# EAGLE schematic Electronic DC Load_v2 (EAGLE 8.2.2)
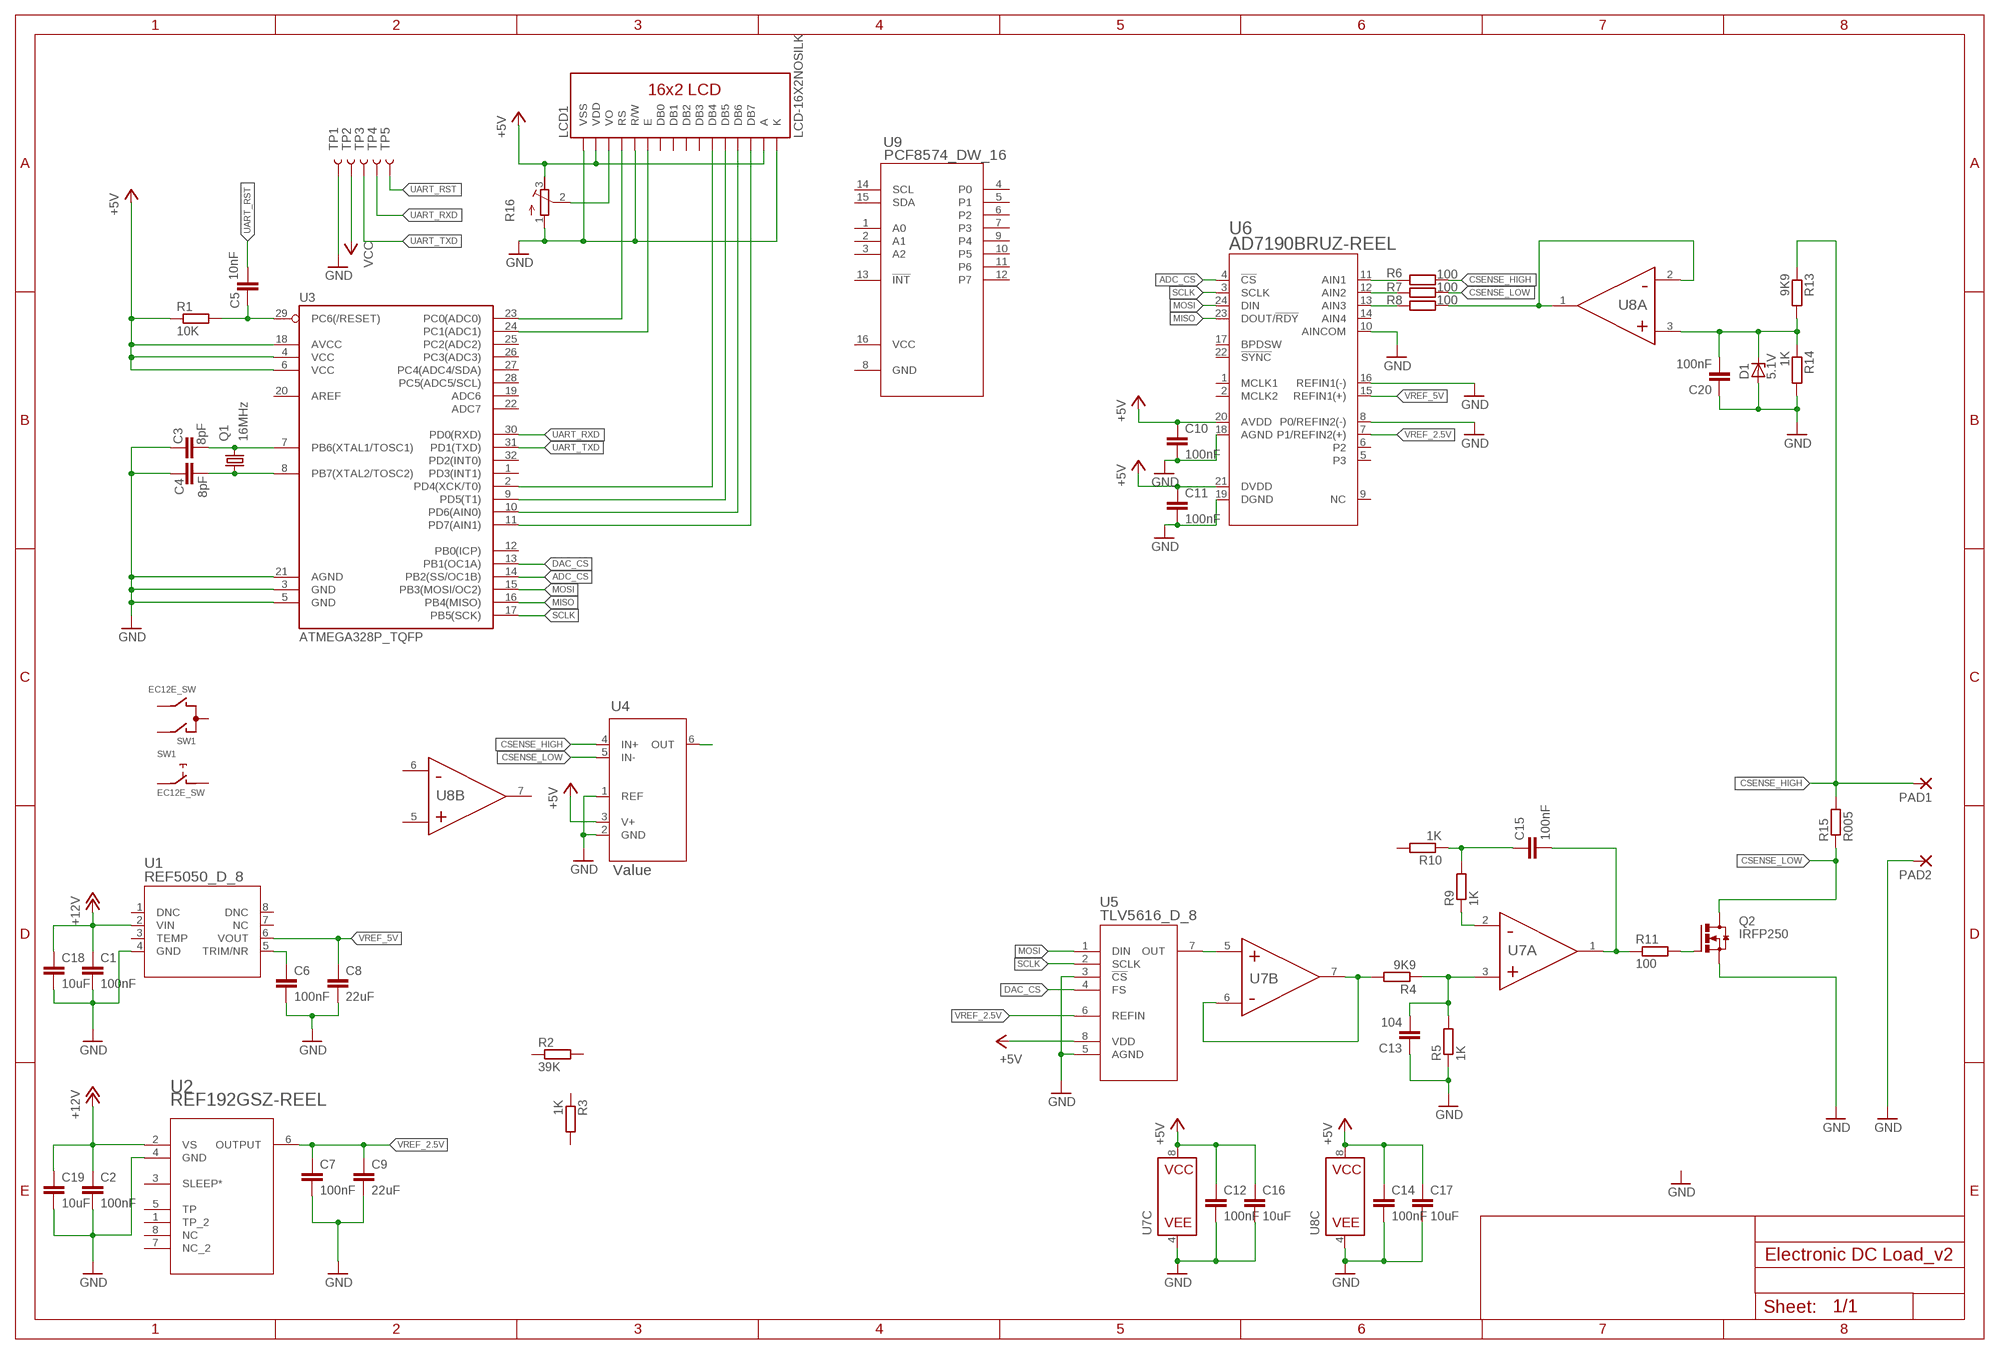
[diagram p0: schematic, sheet 1]

## Parts
C1  100nF  C-EUC1206  [C1206]
C2  100nF  C-EUC1206  [C1206]
C3  8pF  C-EUC0603  [C0603]
C4  8pF  C-EUC0603  [C0603]
C5  10nF  C-EUC0603  [C0603]
C6  100nF  C-EUC1206  [C1206]
C7  100nF  C-EUC1206  [C1206]
C8  22uF  C-EUC1206  [C1206]
C9  22uF  C-EUC1206  [C1206]
C10  100nF  C-EUC0603  [C0603]
C11  100nF  C-EUC0603  [C0603]
C12  100nF  C-EUC1206  [C1206]
C13  104  C-EUC0603  [C0603]
C14  100nF  C-EUC1206  [C1206]
C15  100nF  C-EUC0603  [C0603]
C16  10uF  C-EUC1206  [C1206]
C17  10uF  C-EUC1206  [C1206]
C18  10uF  C-EUC1206  [C1206]
C19  10uF  C-EUC1206  [C1206]
C20  100nF  C-EUC0603  [C0603]
D1  5.1V  ZENER-DIODESOD80C  [SOD80C]
LCD1  LCD-16X2NOSILK  [LCD-16X2_NOSILK]
PAD1  SMD5  [SMD2,54-5,08]
PAD2  SMD5  [SMD2,54-5,08]
Q1  16MHz  KX-7  [3.2X2.5_KX-7]
Q2  IRFP250  [TO-247AD-V]
R1  10K  R-EU_R0603  [R0603]
R2  39K  R-EU_M0805  [M0805]
R3  1K  R-EU_R0805  [R0805]
R4  9K9  R-EU_R0603  [R0603]
R5  1K  R-EU_R0603  [R0603]
R6  100  R-EU_R0805  [R0805]
R7  100  R-EU_R0805  [R0805]
R8  100  R-EU_R0805  [R0805]
R9  1K  R-EU_R0603  [R0603]
R10  1K  R-EU_R0603  [R0603]
R11  100  R-EU_R0603  [R0603]
R13  9K9  R-EU_R0805  [R0805]
R14  1K  R-EU_R0805  [R0805]
R15  R005  MRE_R005_4W_2728  [2728]
R16  R-TRIMM3296X  [RTRIM3296X]
SW1  EC12E_SW  [ALPS_EC12E_SW]
TP1  TEST-POINT2  [PAD.02X.02]
TP2  TEST-POINT3  [PAD.03X.03]
TP3  TEST-POINT3  [PAD.03X.03]
TP4  TEST-POINT3  [PAD.03X.03]
TP5  TEST-POINT3  [PAD.03X.03]
U1  REF5050_D_8  [D8]
U2  REF192GSZ-REEL  [R_8]
U3  ATMEGA328P_TQFP  [TQFP32-08]
U4  Value  INA210AIDCKRG4  [DCK0006A_N]
U5  TLV5616_D_8  [D8]
U6  AD7190BRUZ-REEL  [RU_24]
U7  AD8629ARZ  [R_8]
U8  AD8629ARZ  [R_8]
U9  PCF8574_DW_16  [DW16]

## Nets
+5V: C10.1 C11.1 C12.1 C16.1 U4.3(V+) U5.8(VDD) U6.20(AVDD) U6.21(DVDD) U7.8(C:VCC)
ADC_CS: U3.14(PB2(SS/OC1B)) U6.4(!CS)
CSENSE_HIGH: PAD1.1(P) R6.2 R13.1 R15.2 U4.4(IN+)
CSENSE_LOW: Q2.D R7.2 R15.1 U4.5(IN-)
CURRENT_SENSE: R6.1 U6.11(AIN1)
DAC_CS: U3.13(PB1(OC1A)) U5.4(FS)
GND: C1.2 C2.2 C3.1 C4.1 C6.2 C7.2 C8.2 C9.2 C10.2 C11.2 C13.1 C14.2 C17.2 C18.2 C19.2 C20.1 D1.A LCD1.1(VSS) LCD1.5(R/W) LCD1.16(K) PAD2.1(P) Q2.S R5.1 R14.2 R16.1(A) TP1.P$1 U1.4(GND) U2.4(GND) U3.3(GND) U3.5(GND) U3.21(AGND) U4.1(REF) U4.2(GND) U5.3(!CS) U5.5(AGND) U6.8(P0/REFIN2(-)) U6.10(AINCOM) U6.16(REFIN1(-)) U6.18(AGND) U6.19(DGND) U8.4(C:VEE)
MISO: U3.16(PB4(MISO)) U6.23(DOUT/!RDY)
MOSI: U3.15(PB3(MOSI/OC2)) U5.1(DIN) U6.24(DIN)
N$1: U5.7(OUT) U7.5(B:IN+)
N$2: R9.1 U7.2(A:IN-)
N$3: R7.1 U6.12(AIN2)
N$4: U4.6(OUT)
N$5: C6.1 U1.5(TRIM/NR)
N$6: LCD1.3(VO) R16.2(S)
N$7: Q2.G R11.2
N$8: R8.2 U8.1(A:OUT) U8.2(A:IN-)
N$9: C15.1 R9.2 R10.1
N$11: C3.2 Q1.3 U3.7(PB6(XTAL1/TOSC1))
N$12: C4.2 Q1.1 U3.8(PB7(XTAL2/TOSC2))
N$13: C13.2 R4.1 R5.2 U7.3(A:IN+)
N$14: C20.2 D1.C R13.2 R14.1 U8.3(A:IN+)
N$15: C5.1 R1.2 U3.29(PC6(/RESET))
N$17: LCD1.11(DB4) U3.2(PD4(XCK/T0))
N$18: LCD1.12(DB5) U3.9(PD5(T1))
N$19: LCD1.13(DB6) U3.10(PD6(AIN0))
N$20: LCD1.14(DB7) U3.11(PD7(AIN1))
N$21: LCD1.4(RS) U3.23(PC0(ADC0))
N$22: LCD1.6(E) U3.24(PC1(ADC1))
N$23: R8.1 U6.13(AIN3)
N$24: C15.2 R11.1 U7.1(A:OUT)
N$28: R4.2 U7.6(B:IN-) U7.7(B:OUT)
SCLK: U3.17(PB5(SCK)) U5.2(SCLK) U6.3(SCLK)
UART_RST: C5.2 TP5.P$1
UART_RXD: TP4.P$1 U3.30(PD0(RXD))
UART_TXD: TP3.P$1 U3.31(PD1(TXD))
VCC: C1.1 C2.1 C14.1 C17.1 C18.1 C19.1 LCD1.2(VDD) LCD1.15(A) R1.1 R16.3(E) TP2.P$1 U1.2(VIN) U2.2(VS) U3.4(VCC) U3.6(VCC) U3.18(AVCC) U8.8(C:VCC) ; supply symbol labelled +5V, +12V
VEE: C12.2 C16.2 U7.4(C:VEE) ; supply symbol labelled GND
VREF_2.5V: C7.1 C9.1 U2.6(OUTPUT) U5.6(REFIN) U6.7(P1/REFIN2(+))
VREF_5V: C8.1 U1.6(VOUT) U6.15(REFIN1(+))
Unconnected: LCD1.7(DB0) LCD1.8(DB1) LCD1.9(DB2) LCD1.10(DB3) R2.1 R2.2 R3.1 R3.2 R10.2 SW1.A SW1.B SW1.C SW1.D SW1.E SW1.GND1(G) SW1.GND2(G) U1.1(DNC) U1.3(TEMP) U1.7(NC) U1.8(DNC) U2.1(TP_2) U2.3(SLEEP*) U2.5(TP) U2.7(NC_2) U2.8(NC) U3.1(PD3(INT1)) U3.12(PB0(ICP)) U3.19(ADC6) U3.20(AREF) U3.22(ADC7) U3.25(PC2(ADC2)) U3.26(PC3(ADC3)) U3.27(PC4(ADC4/SDA)) U3.28(PC5(ADC5/SCL)) U3.32(PD2(INT0)) U6.1(MCLK1) U6.2(MCLK2) U6.5(P3) U6.6(P2) U6.9(NC) U6.14(AIN4) U6.17(BPDSW) U6.22(!SYNC) U8.5(B:IN+) U8.6(B:IN-) U8.7(B:OUT) U9.1(A0) U9.2(A1) U9.3(A2) U9.4(P0) U9.5(P1) U9.6(P2) U9.7(P3) U9.9(P4) U9.10(P5) U9.11(P6) U9.12(P7) U9.13(!INT) U9.14(SCL) U9.15(SDA)

## Power pins joined to a net without a drawn wire
GND: U9.8(GND)
VCC: U9.16(VCC)

## Library data of the parts
C1-C20 = resistor:C-EU: CAPACITOR, European symbol
D1 = diode:ZENER-DIODE: Z-Diode
LCD1 = SparkFun-Displays:LCD-16X2: Standard text-only 16x2 parallel input LCD Basic 16 character by 2 line display. Typically utilizes the extremely common HD44780 parallel interface chipset SparkFun Products: Basic 16x2 Green <https://www.sparkfun.com/products/255> Basic 8x2 Green <https://www.sparkfun.com/products/11122>; SF_ID: LCD-00255
PAD1 PAD2 = wirepad:SMD5: SMD PAD
Q1 = crystal-geyer_V1_0:KX: Quartz Crystals (MHz) SMD: KX - Serie Model Size l/w/h [mm] Frequency Range Frequency Stability Temp. Range [°C] Load Capacitance AECQ 200 availabel Datasheet KX-4 KX-5 KX-6 KX-7 KX-9A KX-9B KX-12A KX-12B KX-13 KX-20 KX-K KX-KS 1.6/1.2/0.3 2.0/1.6/0.45 2.5/2.0/0.55 3.2/2.5/0.8 5.0/3.2/1.0 5.0/3.2/1.1 6.0/3.5/1.1 6.0/3.5/1.0 7.0/5.0 /1.3 11.6/5.5/1.6 12.3/4.5/4.2 12.3/4.5/3.2 24.0 ~ 80.0 MHz 16.0 ~ 80.0 MHz 12.0 ~ 80.0 MHz 8.0 ~ 60.0 MHz 7,68 ~ 300,0 MHz 8,0 ~ 50,0 MHz 8,0 ~ 150,0 MHz 8,0 ~ 50,0 MHz 6,0 ~ 160,0 MHz 3,579 ~ 25,0 MHz 3,579 ~ 70,0 MHz 3,579 ~ 70,0 MHz ±10 … ±50ppm ±10 … ±50ppm ±10 … ±50ppm ±10 … ±50ppm ±10 … ±50ppm ±10 … ±50ppm ±10 … ±50ppm ±10 … ±50ppm ±10 … ±50ppm ±50ppm ±10 … ±50ppm ±10 … ±50ppm (*) -40°C …+85°C (*) -40°C …+125°C (*) -40°C …+125°C (*) -40°C …+125°C (*) -40°C …+105°C (*) -40°C …+105°C (*) -40°C …+125°C (*) -40°C …+105°C (*) -40°C …+105°C (*) -40°C …+105°C (*) -40°C …+85°C (*) -40°C …+85°C 8, 8…16 8, 8…16 10, 8…16 12, 7…20 16, 10…20 16, 10…20 16, 10…20 16, 12…20 16, 12…20 16, 12…20 16, 12…30 16, 12…30 - yes yes yes - - - - - - - - KX-4.pdf <http://www.geyer-electronic.de/uploads/tx_userartikelfrequenz/GEYER-KX-4.pdf> KX-5.pdf <http://www.geyer-electronic.de/uploads/tx_userartikelfrequenz/GEYER-KX-5.pdf> KX-6.pdf <http://www.geyer-electronic.de/uploads/tx_userartikelfrequenz/GEYER-KX-6.pdf> KX-7.pdf <http://www.geyer-electronic.de/uploads/tx_userartikelfrequenz/GEYER-KX-7.pdf> KX-9A.pdf <http://www.geyer-electronic.de/uploads/tx_userartikelfrequenz/GEYER-KX-9A.pdf> KX-9B.pdf <http://www.geyer-electronic.de/uploads/tx_userartikelfrequenz/GEYER-KX-9B.pdf> KX-12A.pdf <http://www.geyer-electronic.de/uploads/tx_userartikelfrequenz/GEYER-KX-12A.pdf> KX-12B.pdf <http://www.geyer-electronic.de/uploads/tx_userartikelfrequenz/GEYER-KX-12B.pdf> KX-13.pdf <http://www.geyer-electronic.de/uploads/tx_userartikelfrequenz/GEYER-KX-13.pdf> KX-20.pdf <http://www.geyer-electronic.de/uploads/tx_userartikelfrequenz/GEYER-KX-20.pdf> KX-K.pdf <http://www.geyer-electronic.de/uploads/tx_userartikelfrequenz/GEYER-KX-K.pdf> KX-KS.pdf <http://www.geyer-electronic.de/uploads/tx_userartikelfrequenz/GEYER-KX-KS.pdf> <http://www.geyer-electronic.de/fileadmin/template/img/logo-geyer-electronic.png> Details see: http://www.geyer-electronic.de/Frequenz-Produkte.9.0.html Created 2016-06-07, Hans Locher 2016 (C) Geyer Quartz Technology KX4,KX5,KX6,KX7,KX9A,KX9B,KX12A,KX12B,KX13,KX20,KXK,KXKS;1612;2016;2520;3225;5032;6035;7050;11655;12345;1,6x1,2;2,0x1,6;2,5x2,0;3,2x2,5;5,0x3,2;6,0x3,5;7,0x5,0;11,6x5,5;12,3x4,5;12,3x4,5;1.6x1.2;2.0x1.6;2.5x2.0;3.2x2.5;5.0x3.2;6.0x3.5;7.0x5.0;11.6x5.5;12.3x4.5;12.3x4.5;
Q2 = transistor-power:IRFP25*: 33A/27A, 200V/150V, 0.085/0.012 Ohm, N-Channel Power MOSFET Source: Fairchild Semiconductor Corporation
R1-R11 R13 R14 = resistor:R-EU_: RESISTOR, European symbol
R15 = sup:MRE_R005_4W_2728: Meta Alloy Low-Resistance Resistor
R16 = resistor:R-TRIMM: Trimm resistor
SW1 = alps:EC12E_SW: ALPS rotary Encoder EC12E series with switch; MPN: EC12E2424407; OC_FARNELL: 1520813; OC_NEWARK: 74M1068
TP1-TP5 = SparkFun-Connectors:TEST-POINT: SparkFun Test Points Bare copper test points for troubleshooting or In-Circuit-Testing. These are used by our Production team for verifying production board runs using pogo-pins on test beds. SparkFun Products: SparkFun LSM9DS1 Breakout <https://www.sparkfun.com/products/13284> SparkFun PSOC <https://www.sparkfun.com/products/13714> SparkFun Load Cell Amplifier <https://www.sparkfun.com/products/13879>
U1 = texas_instrument:REF5050_D_8; DATASHEETURL: httpwww.ti.comlitgpnREF5050; FAMILY_NAME: SERIES VOLTAGE REFERENCE; GENERIC_PART_NUMBER: REF5050; INDUSTRY_STD_PKG_TYPE: SOIC; MANUFACTURER: Texas Instruments; MANUFACTURER_PART_NUMBER: ref5050_d_8; PACKAGE_DESIGNATOR: D; PIN_COUNT: 8; VENDOR: Texas Instruments
U2 = analog_devices:REF192GSZ-REEL; MANUFACTURER_PART_NUMBER: REF192GSZREEL; VENDOR: Vendor
U3 = SparkFun-IC-Microcontroller:ATMEGA328P_TQFP: Popular 328P in QFP Storefront component: ATmega328 - TQFP <https://www.sparkfun.com/products/13448> (COM-13448) Datasheet <http://www.sparkfun.com/datasheets/Components/SMD/ATMega328.pdf> SparkFun Products SparkFun RedBoard - Programmed with Arduino <https://www.sparkfun.com/products/12757> (DEV-12757) Arduino Pro Mini 328 - 5V/16MHz <https://www.sparkfun.com/products/11113> (DEV-11113) Arduino Pro Mini 328 - 3.3V/8MHz <https://www.sparkfun.com/products/11114> (DEV-11114) SparkFun OpenLog <https://www.sparkfun.com/products/13712> (DEV-13712) SparkFun MicroView - OLED Arduino Module <https://www.sparkfun.com/products/12923> (DEV-12923) SparkFun Digital Sandbox <https://www.sparkfun.com/products/12651> (DEV-12651) SparkFun PicoBoard <https://www.sparkfun.com/products/11888> (WIG-11888) Arduino Fio <https://www.sparkfun.com/products/10116> (DEV-10116) LilyPad Arduino 328 Main Board <https://www.sparkfun.com/products/13342> (DEV-13342) SparkFun RedStick <https://www.sparkfun.com/products/13741> (DEV-13741) LilyPad MP3 <https://www.sparkfun.com/products/11013> (DEV-11013) LilyPad Arduino SimpleSnap <https://www.sparkfun.com/products/10941> (DEV-10941) SparkFun Stepoko <https://www.sparkfun.com/products/13899> (ROB-13899) SparkFun Geiger Counter <https://www.sparkfun.com/products/11345> (SEN-11345) SparkFun EL Sequencer <https://www.sparkfun.com/products/12781> (COM-12781) Arduino Pro 328 - 5V/16MHz <https://www.sparkfun.com/products/10915> (DEV-10915) CryptoCape <https://www.sparkfun.com/products/12773> (DEV-12773) SparkFun IR Thermometer Evaluation Board - MLX90614 <https://www.sparkfun.com/products/10740> (SEN-10740) SparkFun RedBot Mainboard <https://www.sparkfun.com/products/12097> (ROB-12097) Arduino Pro 328 - 3.3V/8MHz <https://www.sparkfun.com/products/10914> (DEV-10914) SparkFun Block for Intel® Edison - Arduino <https://www.sparkfun.com/products/13036> (DEV-13036) SparkFun Simon Says - Surface Mount Soldering Kit <https://www.sparkfun.com/products/10935> (KIT-10935) SparkFun 7-Segment Serial Display - Red <https://www.sparkfun.com/products/11441> (COM-11441) SparkFun 7-Segment Serial Display - White <https://www.sparkfun.com/products/11629> (COM-11629) SparkFun 7-Segment Serial Display - Yellow <https://www.sparkfun.com/products/11443> (COM-11443) SparkFun 7-Segment Serial Display - Kelly Green <https://www.sparkfun.com/products/11440> (COM-11440) SparkFun 7-Segment Serial Display - Blue <https://www.sparkfun.com/products/11442> (COM-11442) SparkFun OpenSegment Serial Display - 20mm (Blue) <https://www.sparkfun.com/products/11647> (COM-11647) SparkFun OpenSegment Serial Display - 20mm (Green) <https://www.sparkfun.com/products/11646> (COM-11646) SparkFun OpenSegment Serial Display - 20mm (White) <https://www.sparkfun.com/products/11648> (COM-11648) SparkFun OpenSegment Serial Display - 20mm (Red) <https://www.sparkfun.com/products/11644> (COM-11644) SparkFun OpenSegment Serial Display - 20mm (Yellow) <https://www.sparkfun.com/products/11645> (COM-11645) SparkFun OpenSegment Shield <https://www.sparkfun.com/products/13190> (DEV-13190); PROD_ID: IC-09069
U4 = texas_instrument:INA210AIDCKRG4; ALTERNATEPARTNUMBER: INA210AIDCKT; APPLICATION_BUILDNUMBER: *; COMPTYPE: IC; MANUFACTURER: Texas Instruments; MOUNTTYPE: SMT; PACKAGEREFERENCE: DCK0006A; PARTNUMBER: INA210AIDCKR; PIN_COUNT: 6; REFDES: RefDes; ROHS: Y; TYPE: TYPE
U5 = texas_instrument:TLV5616_D_8; DATASHEETURL: httpwww.ti.comlitgpnTLV5616; FAMILY_NAME: PRECISION DAC =<10MSPS; GENERIC_PART_NUMBER: TLV5616; INDUSTRY_STD_PKG_TYPE: SOIC; MANUFACTURER: Texas Instruments; MANUFACTURER_PART_NUMBER: tlv5616_d_8; PACKAGE_DESIGNATOR: D; PIN_COUNT: 8; VENDOR: Texas Instruments
U6 = analog_devices:AD7190BRUZ-REEL; MANUFACTURER_PART_NUMBER: AD7190BRUZREEL; VENDOR: Vendor
U7 U8 = analog_devices:AD8629ARZ
U9 = texas_instrument:PCF8574_DW_16; MANUFACTURER_PART_NUMBER: pcf8574_dw_16; VENDOR: Texas Instruments